# Altium schematic sheet S01-LAUNCHPAD.SchDoc
size B; SheetNumber: 2; SheetTotal: 7; BLOCK-TITLE: EK-TM4C123GXL LAUNCHPAD HEADERS; BLOCK-SIZE: B; BLOCK-PROJECT: MULTIMOD BASE; BLOCK-REVISION: 1; BLOCK-ORGANIZATION: UNIVERSITY OF FLORIDA; BLOCK-DESIGNER: MEHRON TALEBI; BLOCK-IDENTIFIER: SUMMER 2023; BLOCK-REVIEWER: MIKE STAPLETON
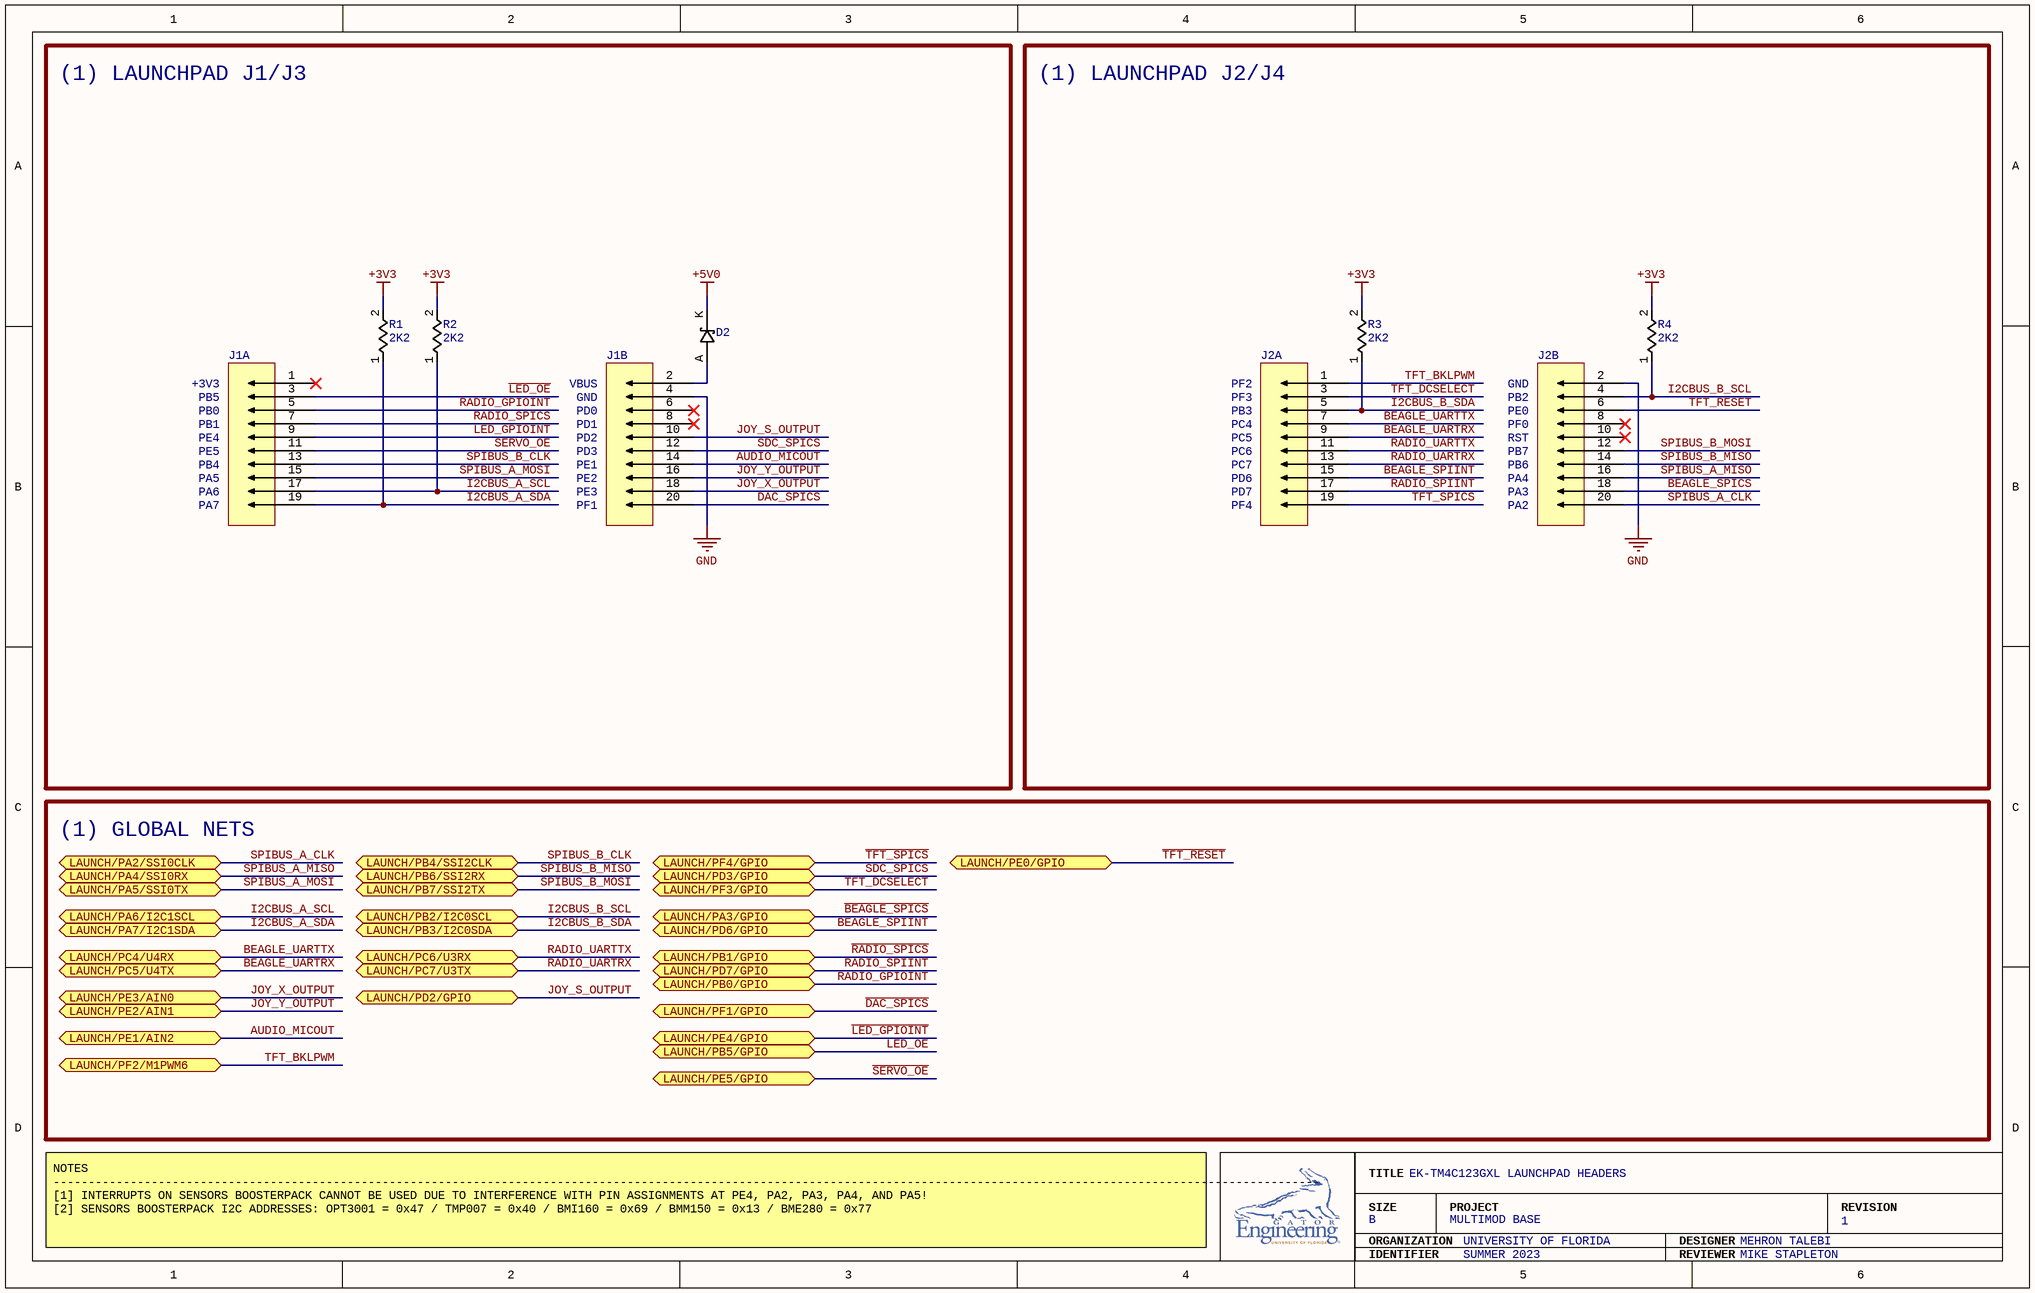
[diagram p0: S01-LAUNCHPAD.SchDoc]

## Parts
D2  RBR5L30BDDTE25  [RBR5L30BDDTE25]  (value not drawn)
J1  95278-101-20LF  [95278-101-20LF]  (value not drawn)  (parts A,B of 2)
J2  95278-101-20LF  [95278-101-20LF]  (value not drawn)  (parts A,B of 2)
R1  2K2  [RC0805FR-072K2L]
R2  2K2  [RC0805FR-072K2L]
R3  2K2  [RC0805FR-072K2L]
R4  2K2  [RC0805FR-072K2L]

## Blocks framed on the sheet
(1) LAUNCHPAD J1/J3: D2 J1 R1 R2
(1) LAUNCHPAD J2/J4: J2 R3 R4

## Ports
LAUNCH/PA2/SSI0CLK (bidir), LAUNCH/PA3/GPIO (bidir), LAUNCH/PA4/SSI0RX (bidir), LAUNCH/PA5/SSI0TX (bidir), LAUNCH/PA6/I2C1SCL (bidir), LAUNCH/PA7/I2C1SDA (bidir), LAUNCH/PB0/GPIO (bidir), LAUNCH/PB1/GPIO (bidir), LAUNCH/PB2/I2C0SCL (bidir), LAUNCH/PB3/I2C0SDA (bidir), LAUNCH/PB4/SSI2CLK (bidir), LAUNCH/PB5/GPIO (bidir), LAUNCH/PB6/SSI2RX (bidir), LAUNCH/PB7/SSI2TX (bidir), LAUNCH/PC4/U4RX (bidir), LAUNCH/PC5/U4TX (bidir), LAUNCH/PC6/U3RX (bidir), LAUNCH/PC7/U3TX (bidir), LAUNCH/PD2/GPIO (bidir), LAUNCH/PD3/GPIO (bidir), LAUNCH/PD6/GPIO (bidir), LAUNCH/PD7/GPIO (bidir), LAUNCH/PE0/GPIO (bidir), LAUNCH/PE1/AIN2 (bidir), LAUNCH/PE2/AIN1 (bidir), LAUNCH/PE3/AIN0 (bidir), LAUNCH/PE4/GPIO (bidir), LAUNCH/PE5/GPIO (bidir), LAUNCH/PF1/GPIO (bidir), LAUNCH/PF2/M1PWM6 (bidir), LAUNCH/PF3/GPIO (bidir), LAUNCH/PF4/GPIO (bidir)

## Nets
+3V3: R1.2 R2.2 R3.2 R4.2
+5V0: D2.K(+)
GND: J1.4 J2.2
~{BEAGLE_SPICS}: J2.18 ; port LAUNCH/PA3/GPIO
~{DAC_SPICS}: J1.20 ; port LAUNCH/PF1/GPIO
~{LED_GPIOINT}: J1.9 ; port LAUNCH/PE4/GPIO
~{LED_OE}: J1.3 ; port LAUNCH/PB5/GPIO
~{RADIO_SPICS}: J1.7 ; port LAUNCH/PB1/GPIO
~{SDC_SPICS}: J1.12 ; port LAUNCH/PD3/GPIO
~{SERVO_OE}: J1.11 ; port LAUNCH/PE5/GPIO
~{TFT_RESET}: J2.6 ; port LAUNCH/PE0/GPIO
~{TFT_SPICS}: J2.19 ; port LAUNCH/PF4/GPIO
AUDIO_MICOUT: J1.14 ; port LAUNCH/PE1/AIN2
BEAGLE_SPIINT: J2.15 ; port LAUNCH/PD6/GPIO
BEAGLE_UARTRX: J2.9 ; port LAUNCH/PC5/U4TX
BEAGLE_UARTTX: J2.7 ; port LAUNCH/PC4/U4RX
I2CBUS_A_SCL: J1.17 R2.1 ; port LAUNCH/PA6/I2C1SCL
I2CBUS_A_SDA: J1.19 R1.1 ; port LAUNCH/PA7/I2C1SDA
I2CBUS_B_SCL: J2.4 R4.1 ; port LAUNCH/PB2/I2C0SCL
I2CBUS_B_SDA: J2.5 R3.1 ; port LAUNCH/PB3/I2C0SDA
JOY_S_OUTPUT: J1.10 ; port LAUNCH/PD2/GPIO
JOY_X_OUTPUT: J1.18 ; port LAUNCH/PE3/AIN0
JOY_Y_OUTPUT: J1.16 ; port LAUNCH/PE2/AIN1
RADIO_GPIOINT: J1.5 ; port LAUNCH/PB0/GPIO
RADIO_SPIINT: J2.17 ; port LAUNCH/PD7/GPIO
RADIO_UARTRX: J2.13 ; port LAUNCH/PC7/U3TX
RADIO_UARTTX: J2.11 ; port LAUNCH/PC6/U3RX
SPIBUS_A_CLK: J2.20 ; port LAUNCH/PA2/SSI0CLK
SPIBUS_A_MISO: J2.16 ; port LAUNCH/PA4/SSI0RX
SPIBUS_A_MOSI: J1.15 ; port LAUNCH/PA5/SSI0TX
SPIBUS_B_CLK: J1.13 ; port LAUNCH/PB4/SSI2CLK
SPIBUS_B_MISO: J2.14 ; port LAUNCH/PB6/SSI2RX
SPIBUS_B_MOSI: J2.12 ; port LAUNCH/PB7/SSI2TX
TFT_BKLPWM: J2.1 ; port LAUNCH/PF2/M1PWM6
TFT_DCSELECT: J2.3 ; port LAUNCH/PF3/GPIO
NetD2_A: D2.A(-) J1.2

Not connected (* = marked no-connect by the designer): J1 1* 6* 8*; J2 8* 10*

## Notes on the sheet
- +3V3
- PB0
- PB1
- PE4
- PB5
- VBUS
- GND
- PD0
- PD1
- PD2
- PF2
- PF3
- PB3
- PC4
- PC5
- PB2
- PE0
- PF0
- RST
- PE5
- PB4
- PA5
- PA6
- PA7
- PD3
- PE1
- PE2
- PE3
- PF1
- PC6
- PC7
- PD6
- PD7
- PF4
- PB7
- PB6
- PA4
- PA3
- PA2
- (1) GLOBAL NETS
- NOTES
  -------------------------------------------------------------------------------------------------------------------------------------------------------------------------------------
  [1] INTERRUPTS ON SENSORS BOOSTERPACK CANNOT BE USED DUE TO INTERFERENCE WITH PIN ASSIGNMENTS AT PE4, PA2, PA3, PA4, AND PA5!
  [2] SENSORS BOOSTERPACK I2C ADDRESSES: OPT3001 = 0x47 / TMP007 = 0x40 / BMI160 = 0x69 / BMM150 = 0x13 / BME280 = 0x77
- TITLE
- SIZE
- ORGANIZATION
- PROJECT
- DESIGNER
- REVISION
- IDENTIFIER
- REVIEWER

## Library data of the parts
D2 = RBR5L30BDDTE25: DIODE SCHOTTKY 30V 5A PMDS; Voltage - Forward (Vf) (Max) @ If: 490 mV @ 5 A; Speed: Fast Recovery =< 500ns, > 200mA (Io); Current - Reverse Leakage @ Vr: 150 µA @ 30 V; Diode Type: Schottky; Voltage - DC Reverse (Vr) (Max): 30 V; Current - Average Rectified (Io): 5A; Mounting Type: Surface Mount; Package / Case: DO-214AC, SMA; Operating Temperature - Junction: -55°C ~ 150°C; Supplier 1: Digi-Key; Supplier Part Number 1: 846-RBR5L30BDDTE25CT-ND
J1 J2 = 95278-101-20LF: CONN HEADER SMD 20POS 2.54MM; Connector Type: Header, Breakaway; Pitch - Mating: 0.100" (2.54mm); Number of Positions: 20; Number of Positions Loaded: All; Style: Board to Board; Shrouding: Unshrouded; Contact Length - Mating: 0.232" (5.90mm); Material Flammability Rating: UL94 V-0; Current Rating (Amps): 3A per Contact; Contact Type: Male Pin; Number of Rows: 2; Row Spacing - Mating: 0.100" (2.54mm); Mounting Type: Surface Mount; Termination: Solder; Fastening Type: Push-Pull; Insulation Height: 0.100" (2.54mm); Contact Shape: Square; Contact Finish - Mating: Gold, GXT™; Contact Finish Thickness - Mating: 30.0µin (0.76µm); Contact Finish - Post: Tin; Contact Material: Phosphor Bronze; Insulation Material: Thermoplastic; Operating Temperature: -65°C ~ 125°C; Insulation Color: Black; Contact Finish Thickness - Post: 78.7µin (2.00µm); Supplier 1: Arrow Electronics; Supplier Part Number 1: 95278-101-20LF
R1-R4 = RC0805FR-072K2L: RES 2.2K OHM 1% 1/8W 0805; Resistance: 2.2 kOhms; Power (Watts): 0.125W, 1/8W; Temperature Coefficient: ±100ppm/°C; Tolerance: ±1%; Composition: Thick Film; Features: Moisture Resistant; Operating Temperature: -55°C ~ 155°C; Package / Case: 0805 (2012 Metric); Supplier Device Package: 0805; Size / Dimension: 0.079" L x 0.049" W (2.00mm x 1.25mm); Height - Seated (Max): 0.024" (0.60mm); Number of Terminations: 2; Supplier 1: Digi-Key; Supplier Part Number 1: 311-2.20KCRDKR-ND